# EAGLE design working (EAGLE 9.1.3)
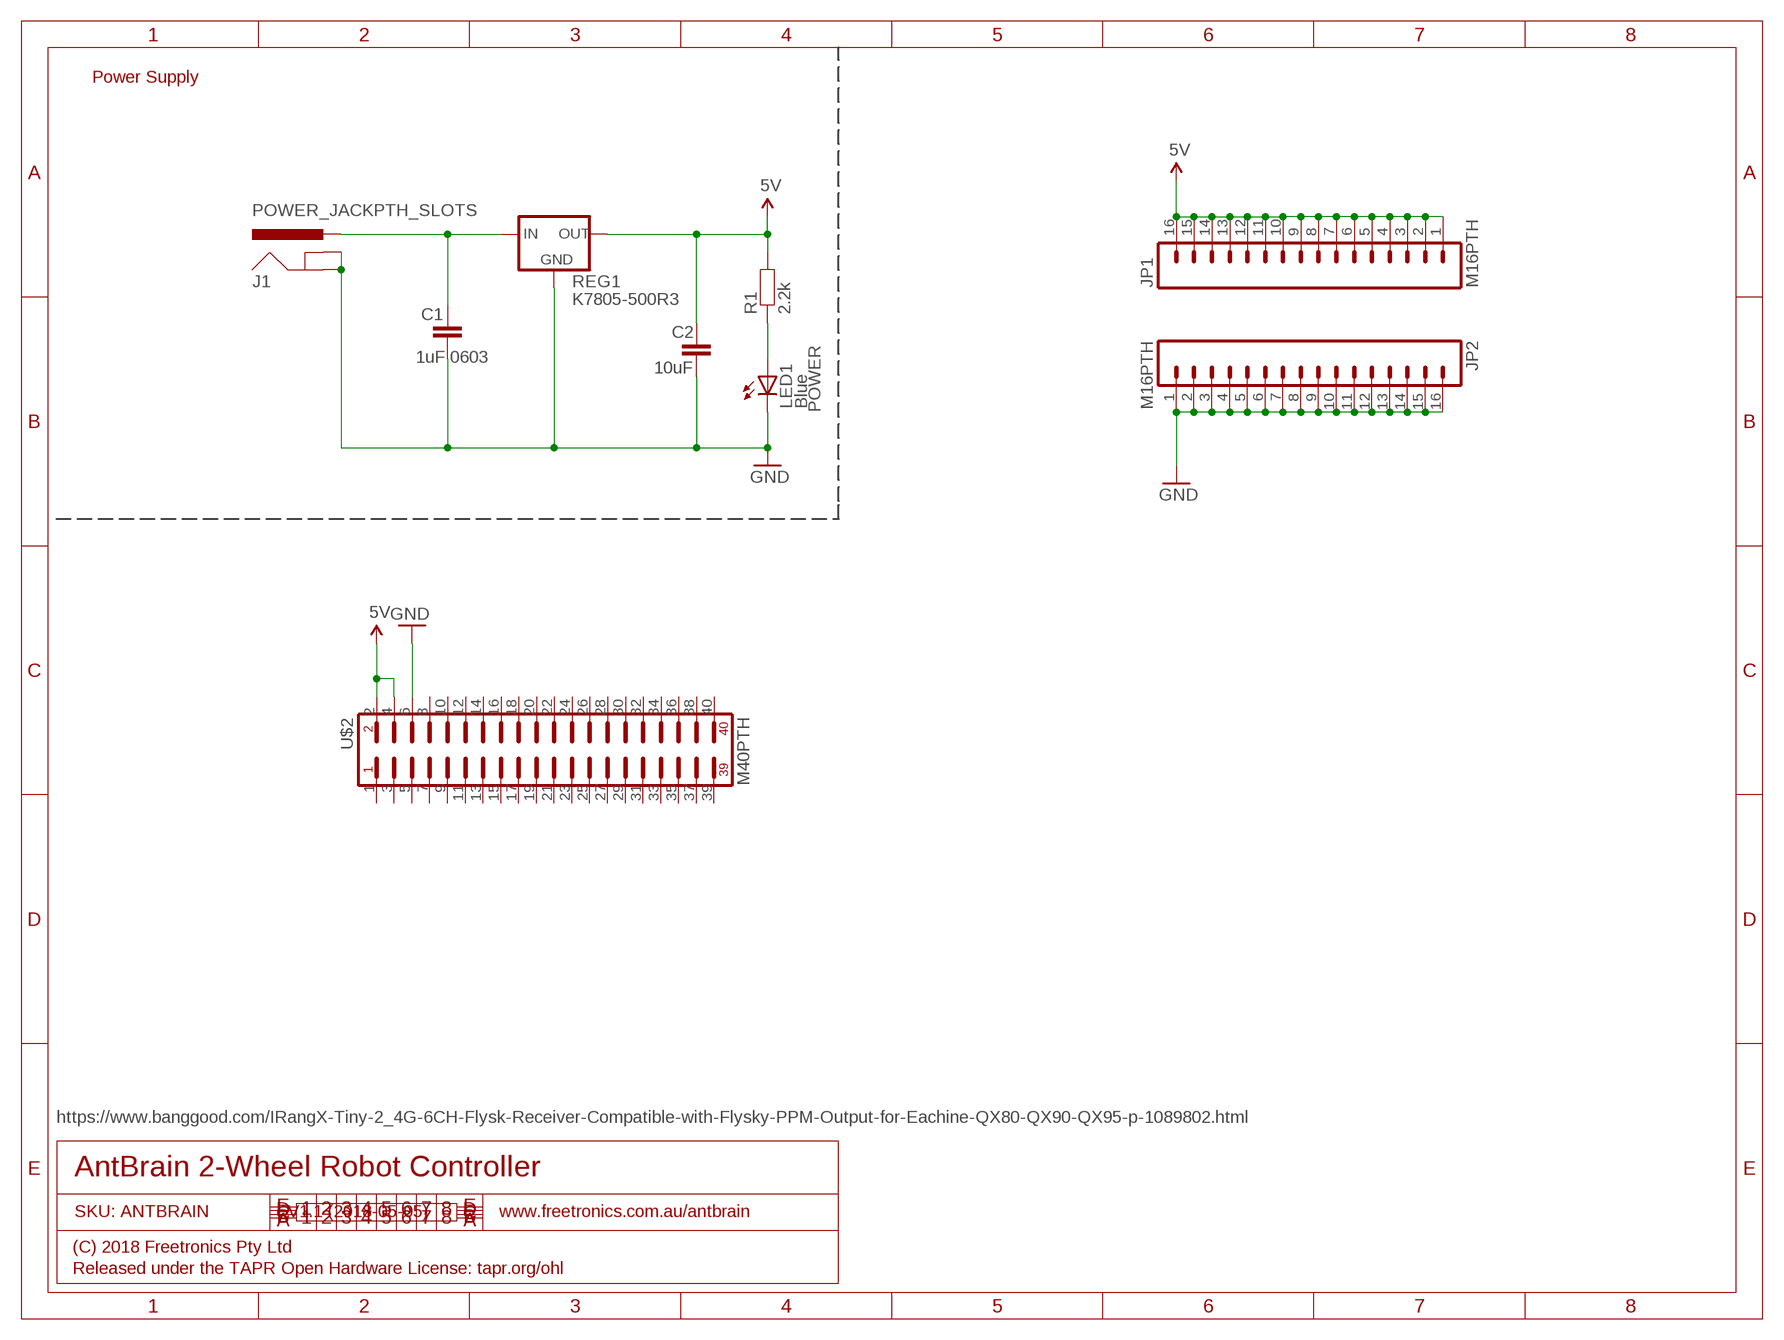
[diagram p0: schematic, sheet 1]

## Parts
C1  1uF 0603  CAP0603  [0603]
C2  10uF  CAP0805  [0805]
J1  POWER_JACKPTH_SLOTS  [POWER_JACK_PTH_SLOTS]
JP1  M16PTH  [1X16]
JP2  M16PTH  [1X16]
LED1  Blue  LED0603  [LED-0603]
R1  2.2k  RESISTOR0603  [0603]
REG1  K7805-500R3  K78XX-500R3  [K78XX-500R3]
U$2  M40PTH  [2X20]

## Nets
5V: C2.1 JP1.1 JP1.2 JP1.3 JP1.4 JP1.5 JP1.6 JP1.7 JP1.8 JP1.9 JP1.10 JP1.11 JP1.12 JP1.13 JP1.14 JP1.15 JP1.16 R1.2 REG1.3(OUT) U$2.2 U$2.4
GND: C1.2 C2.2 J1.GND J1.GNDBREAK JP2.1 JP2.2 JP2.3 JP2.4 JP2.5 JP2.6 JP2.7 JP2.8 JP2.9 JP2.10 JP2.11 JP2.12 JP2.13 JP2.14 JP2.15 JP2.16 LED1.C REG1.2(GND) U$2.6
N$1: LED1.A R1.1
VBAT: C1.1 J1.PWR REG1.1(IN)
Unconnected: U$2.1 U$2.3 U$2.5 U$2.7 U$2.8 U$2.9 U$2.10 U$2.11 U$2.12 U$2.13 U$2.14 U$2.15 U$2.16 U$2.17 U$2.18 U$2.19 U$2.20 U$2.21 U$2.22 U$2.23 U$2.24 U$2.25 U$2.26 U$2.27 U$2.28 U$2.29 U$2.30 U$2.31 U$2.32 U$2.33 U$2.34 U$2.35 U$2.36 U$2.37 U$2.38 U$2.39 U$2.40

## Notes on the sheet
- Power Supply
- POWER
- https://www.banggood.com/IRangX-Tiny-2_4G-6CH-Flysk-Receiver-Compatible-with-Flysky-PPM-Output-for-Eachine-QX80-QX90-QX95-p-1089802.html
- AntBrain 2-Wheel Robot Controller
- SKU: ANTBRAIN | V1.1 (2018-05-05) | www.freetronics.com.au/antbrain
- (C) 2018 Freetronics Pty Ltd
- Released under the TAPR Open Hardware License: tapr.org/ohl

## Library data of the parts
C1 = freetronics:CAP: Capacitor Standard 0603 ceramic capacitor, and 0.1" leaded capacitor.
C2 = freetronics-jon:CAP: Capacitor Standard 0603 ceramic capacitor, and 0.1" leaded capacitor.
J1 = freetronics-jon:POWER_JACK: Power Jack This is the standard 5.5mm barrel jack for power. The PTH is the most common, proven, reliable, footprint. All others are experimental. The Slot footprint only works if the mill layer is transmitted to the PCB fab house so be warned. Spark Fun Electronics SKU : PRT-00119. Mating wall wart : TOL-00298 (and others)
JP1 JP2 = freetronics-jon:M16
LED1 = freetronics-jon:LED: LEDs Standard schematic elements and footprints for 5mm, 3mm, 1206, and 0603 sized LEDs. 5mm - Spark Fun Electronics SKU : COM-00529 (and others)
R1 = freetronics-jon:RESISTOR: Resistor Basic schematic elements and footprints for 0603, 1206, and PTH 1/10th watt (small) resistors.
REG1 = freetronics-jon:K78XX-500R3
U$2 = freetronics-jon:M40

## Board
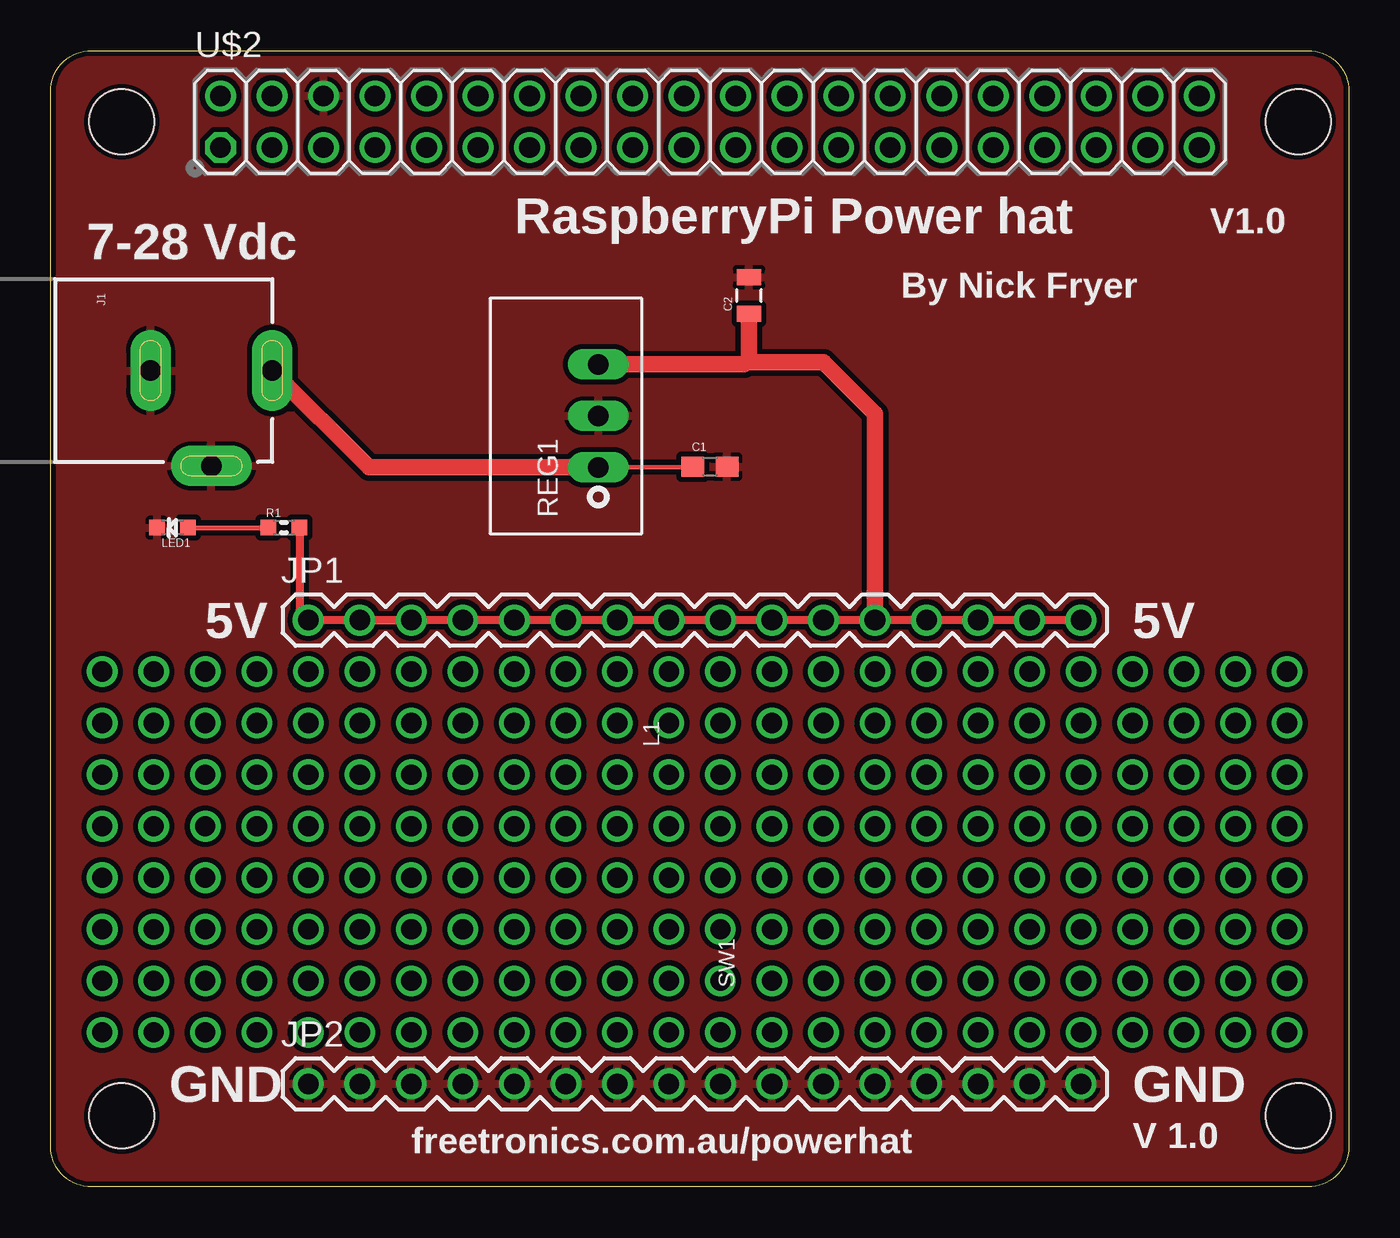
[diagram p1: board, top side]
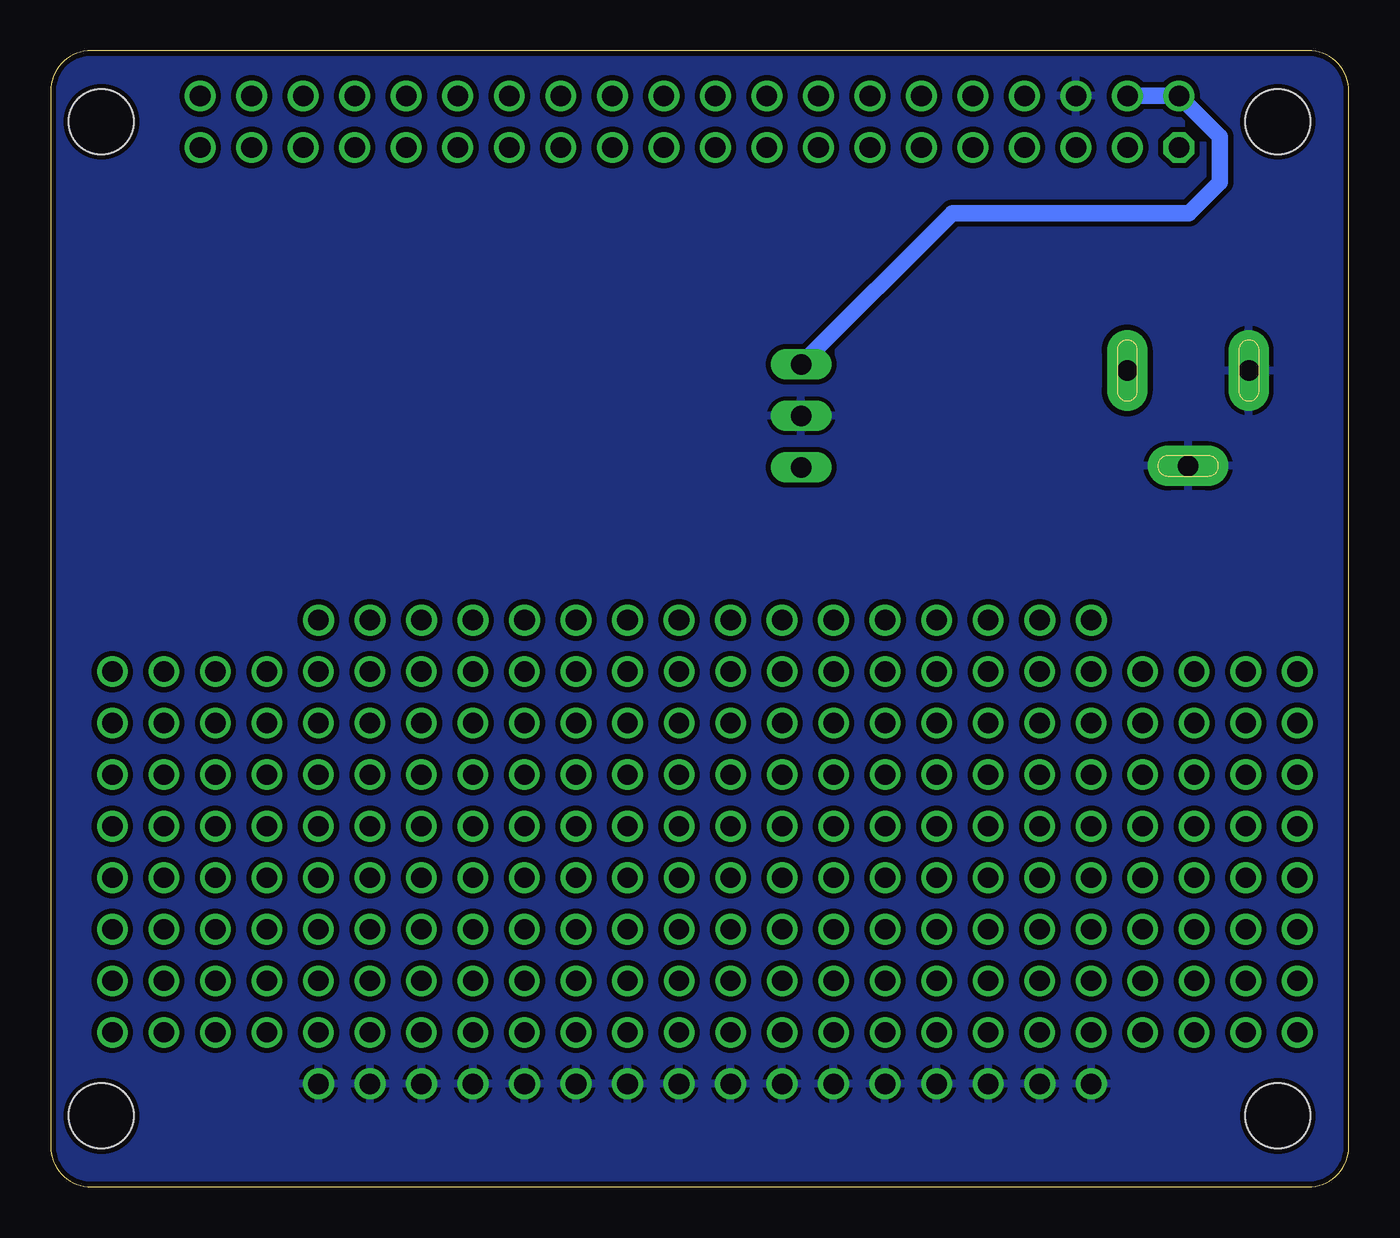
[diagram p2: board, bottom side, seen from below]

Size 64 x 56 mm. Coordinates in mm from the lower left corner, seen from the top.
Outline: 0,54 arc-90 2,56 62,56 arc-90 64,54 64,2 arc-90 62,0 2,0 arc-90 0,2 0,54
Copper layers (1*16): Top 0.035mm / dielectric 1.5mm / Bottom 0.035mm
Design rules "default *": minimum track width 8mil, minimum drill 0.4mm, track to track 8mil, track to pad 8mil, pad to pad 8mil, via to via 8mil, smd to smd 8mil, copper to edge 10mil, drill to drill 8mil, minimum pad ring 8mil, minimum via ring 10mil, stop-mask expansion 3mil, vias tented up to drill 25mil, thermal gap 8mil
Holes 3.2 mm at 3.5,52.5 61.5,52.5 61.5,3.5 3.5,3.5

### Footprints (pad centres in the part's own frame; a part is rotated, then mirrored left to right if it is on the bottom)
0603 = smd 1.1 x 1: 1 -0.85,0; 2 0.85,0
0805 = smd 0.8 x 1.2: 1 -0.9,0; 2 0.9,0
POWER_JACK_PTH_SLOTS = drill 1 pad 2 long: GND 0,7.7; GNDBREAK 4.7,10.7; PWR 0,13.7
1X16 = drill 1.016: 1 0,0; 2 2.54,0; 3 5.08,0; 4 7.62,0; 5 10.16,0; 6 12.7,0; 7 15.24,0; 8 17.78,0; 9 20.32,0; 10 22.86,0; 11 25.4,0; 12 27.94,0; 13 30.48,0; 14 33.02,0; 15 35.56,0; 16 38.1,0
LED-0603 = smd 0.762 x 0.762: A -0.762,0; C 0.762,0
0603' = smd 0.762 x 0.762: 1 -0.762,0; 2 0.762,0
K78XX-500R3 = drill 1 long: 1 -2.54,0; 2 0,0; 3 2.54,0
2X20 = drill 1.016 octagon: 1 0,0 | drill 1.016: 2 0,2.54; 3 2.54,0; 4 2.54,2.54; 5 5.08,0; 6 5.08,2.54; 7 7.62,0; 8 7.62,2.54; 9 10.16,0; 10 10.16,2.54; 11 12.7,0; 12 12.7,2.54; 13 15.24,0; 14 15.24,2.54; 15 17.78,0; 16 17.78,2.54; 17 20.32,0; 18 20.32,2.54; 19 22.86,0; 20 22.86,2.54; 21 25.4,0; 22 25.4,2.54; 23 27.94,0; 24 27.94,2.54; 25 30.48,0; 26 30.48,2.54; 27 33.02,0; 28 33.02,2.54; 29 35.56,0; 30 35.56,2.54; 31 38.1,0; 32 38.1,2.54; 33 40.64,0; 34 40.64,2.54; 35 43.18,0; 36 43.18,2.54; 37 45.72,0; 38 45.72,2.54; 39 48.26,0; 40 48.26,2.54

### Placement (x,y rotation side)
C1  32.5,35.5 0 top
C2  34.43,43.93 90 top
J1  -2.78,40.24 270 top
JP1  12.7,27.94 0 top
JP2  12.7,5.08 0 top
LED1  6,32.5 180 top
R1  2.2k  [0603']  11.5,32.5 0 top
REG1  27,38 90 top
U$2  8.37,51.23 0 top

### Tracks (layer width: path | path; a pad name or v marks a point on that pad's centre or on a via)
5V
  Top 0.406: JP1.16 JP1.15 JP1.14 JP1.13 JP1.12 JP1.11 JP1.10 JP1.9 JP1.8 JP1.7 JP1.6 JP1.5 JP1.4 JP1.3 | JP1.3 JP1.1 12.26,28.38 R1.2 | JP1.2 JP1.3
  Top 0.813: REG1.3 34.19,40.54 | C2.1 34.43,40.78 34.19,40.54 | 34.19,40.54 | 34.19,40.54 34.29,40.64 38.1,40.64 40.64,38.1 JP1.12
  Bottom 0.813: REG1.3 19.54,48 7.88,48 6.35,49.53 6.35,51.75 U$2.2 U$2.4
GND
  pour Top (isolate 0.254): 2,56 64,56 64,0 2,0 arc-90 0,2 0,54 arc-90
  pour Bottom (isolate 0.254): 2,56.32 61.94,56.32 arc-90 63.94,54.32 63.94,2 arc-90 61.94,0 2,0 arc-90 0,2 0,54.32 arc-90
N$1
  Top 0.254: LED1.A R1.1
N$2  (via drill 1)
  other vias: 7.62,25.4
N$3  (via drill 1)
  other vias: 10.16,25.4
N$4  (via drill 1)
  other vias: 12.7,25.4
N$5  (via drill 1)
  other vias: 15.24,25.4
N$6  (via drill 1)
  other vias: 17.78,25.4
N$7  (via drill 1)
  other vias: 20.32,25.4
N$8  (via drill 1)
  other vias: 22.86,25.4
N$9  (via drill 1)
  other vias: 25.4,25.4
N$10  (via drill 1)
  other vias: 27.94,25.4
N$11  (via drill 1)
  other vias: 30.48,25.4
N$12  (via drill 1)
  other vias: 33.02,25.4
N$13  (via drill 1)
  other vias: 35.56,25.4
N$14  (via drill 1)
  other vias: 38.1,25.4
N$15  (via drill 1)
  other vias: 40.64,25.4
N$16  (via drill 1)
  other vias: 43.18,25.4
N$17  (via drill 1)
  other vias: 45.72,25.4
N$18  (via drill 1)
  other vias: 48.26,25.4
N$19  (via drill 1)
  other vias: 50.8,25.4
N$20  (via drill 1)
  other vias: 53.34,25.4
N$21  (via drill 1)
  other vias: 55.88,25.4
N$22  (via drill 1)
  other vias: 58.42,25.4
N$23  (via drill 1)
  other vias: 60.96,25.4
N$24  (via drill 1)
  other vias: 5.08,25.4
N$25  (via drill 1)
  other vias: 2.54,25.4
N$26  (via drill 1)
  other vias: 7.62,22.86
N$27  (via drill 1)
  other vias: 10.16,22.86
N$28  (via drill 1)
  other vias: 12.7,22.86
N$29  (via drill 1)
  other vias: 15.24,22.86
N$30  (via drill 1)
  other vias: 17.78,22.86
N$31  (via drill 1)
  other vias: 20.32,22.86
N$32  (via drill 1)
  other vias: 22.86,22.86
N$33  (via drill 1)
  other vias: 25.4,22.86
N$34  (via drill 1)
  other vias: 27.94,22.86
N$35  (via drill 1)
  other vias: 30.48,22.86
N$36  (via drill 1)
  other vias: 33.02,22.86
N$37  (via drill 1)
  other vias: 35.56,22.86
N$38  (via drill 1)
  other vias: 38.1,22.86
N$39  (via drill 1)
  other vias: 40.64,22.86
N$40  (via drill 1)
  other vias: 43.18,22.86
N$41  (via drill 1)
  other vias: 45.72,22.86
N$42  (via drill 1)
  other vias: 48.26,22.86
N$43  (via drill 1)
  other vias: 50.8,22.86
N$44  (via drill 1)
  other vias: 53.34,22.86
N$45  (via drill 1)
  other vias: 55.88,22.86
N$46  (via drill 1)
  other vias: 58.42,22.86
N$47  (via drill 1)
  other vias: 60.96,22.86
N$48  (via drill 1)
  other vias: 5.08,22.86
N$49  (via drill 1)
  other vias: 2.54,22.86
N$50  (via drill 1)
  other vias: 7.62,20.32
N$51  (via drill 1)
  other vias: 10.16,20.32
N$52  (via drill 1)
  other vias: 12.7,20.32
N$53  (via drill 1)
  other vias: 15.24,20.32
N$54  (via drill 1)
  other vias: 17.78,20.32
N$55  (via drill 1)
  other vias: 20.32,20.32
N$56  (via drill 1)
  other vias: 22.86,20.32
N$57  (via drill 1)
  other vias: 25.4,20.32
N$58  (via drill 1)
  other vias: 27.94,20.32
N$59  (via drill 1)
  other vias: 30.48,20.32
N$60  (via drill 1)
  other vias: 33.02,20.32
N$61  (via drill 1)
  other vias: 35.56,20.32
N$62  (via drill 1)
  other vias: 38.1,20.32
N$63  (via drill 1)
  other vias: 40.64,20.32
N$64  (via drill 1)
  other vias: 43.18,20.32
N$65  (via drill 1)
  other vias: 45.72,20.32
N$66  (via drill 1)
  other vias: 48.26,20.32
N$67  (via drill 1)
  other vias: 50.8,20.32
N$68  (via drill 1)
  other vias: 53.34,20.32
N$69  (via drill 1)
  other vias: 55.88,20.32
N$70  (via drill 1)
  other vias: 58.42,20.32
N$71  (via drill 1)
  other vias: 60.96,20.32
N$72  (via drill 1)
  other vias: 5.08,20.32
N$73  (via drill 1)
  other vias: 2.54,20.32
N$74  (via drill 1)
  other vias: 7.62,17.78
N$75  (via drill 1)
  other vias: 10.16,17.78
N$76  (via drill 1)
  other vias: 12.7,17.78
N$77  (via drill 1)
  other vias: 15.24,17.78
N$78  (via drill 1)
  other vias: 17.78,17.78
N$79  (via drill 1)
  other vias: 20.32,17.78
N$80  (via drill 1)
  other vias: 22.86,17.78
N$81  (via drill 1)
  other vias: 25.4,17.78
N$82  (via drill 1)
  other vias: 27.94,17.78
N$83  (via drill 1)
  other vias: 30.48,17.78
N$84  (via drill 1)
  other vias: 33.02,17.78
N$85  (via drill 1)
  other vias: 35.56,17.78
N$86  (via drill 1)
  other vias: 38.1,17.78
N$87  (via drill 1)
  other vias: 40.64,17.78
N$88  (via drill 1)
  other vias: 43.18,17.78
N$89  (via drill 1)
  other vias: 45.72,17.78
N$90  (via drill 1)
  other vias: 48.26,17.78
N$91  (via drill 1)
  other vias: 50.8,17.78
N$92  (via drill 1)
  other vias: 53.34,17.78
N$93  (via drill 1)
  other vias: 55.88,17.78
N$94  (via drill 1)
  other vias: 58.42,17.78
N$95  (via drill 1)
  other vias: 60.96,17.78
N$96  (via drill 1)
  other vias: 5.08,17.78
N$97  (via drill 1)
  other vias: 2.54,17.78
N$98  (via drill 1)
  other vias: 7.62,15.24
N$99  (via drill 1)
  other vias: 10.16,15.24
N$100  (via drill 1)
  other vias: 12.7,15.24
N$101  (via drill 1)
  other vias: 15.24,15.24
N$102  (via drill 1)
  other vias: 17.78,15.24
N$103  (via drill 1)
  other vias: 20.32,15.24
N$104  (via drill 1)
  other vias: 22.86,15.24
N$105  (via drill 1)
  other vias: 25.4,15.24
N$106  (via drill 1)
  other vias: 27.94,15.24
N$107  (via drill 1)
  other vias: 30.48,15.24
N$108  (via drill 1)
  other vias: 33.02,15.24
N$109  (via drill 1)
  other vias: 35.56,15.24
N$110  (via drill 1)
  other vias: 38.1,15.24
N$111  (via drill 1)
  other vias: 40.64,15.24
N$112  (via drill 1)
  other vias: 43.18,15.24
N$113  (via drill 1)
  other vias: 45.72,15.24
N$114  (via drill 1)
  other vias: 48.26,15.24
N$115  (via drill 1)
  other vias: 50.8,15.24
N$116  (via drill 1)
  other vias: 53.34,15.24
N$117  (via drill 1)
  other vias: 55.88,15.24
N$118  (via drill 1)
  other vias: 58.42,15.24
N$119  (via drill 1)
  other vias: 60.96,15.24
N$120  (via drill 1)
  other vias: 5.08,15.24
N$121  (via drill 1)
  other vias: 2.54,15.24
N$122  (via drill 1)
  other vias: 7.62,12.7
N$123  (via drill 1)
  other vias: 10.16,12.7
N$124  (via drill 1)
  other vias: 12.7,12.7
N$125  (via drill 1)
  other vias: 15.24,12.7
N$126  (via drill 1)
  other vias: 17.78,12.7
N$127  (via drill 1)
  other vias: 20.32,12.7
N$128  (via drill 1)
  other vias: 22.86,12.7
N$129  (via drill 1)
  other vias: 25.4,12.7
N$130  (via drill 1)
  other vias: 27.94,12.7
N$131  (via drill 1)
  other vias: 30.48,12.7
N$132  (via drill 1)
  other vias: 33.02,12.7
N$133  (via drill 1)
  other vias: 35.56,12.7
N$134  (via drill 1)
  other vias: 38.1,12.7
N$135  (via drill 1)
  other vias: 40.64,12.7
N$136  (via drill 1)
  other vias: 43.18,12.7
N$137  (via drill 1)
  other vias: 45.72,12.7
N$138  (via drill 1)
  other vias: 48.26,12.7
N$139  (via drill 1)
  other vias: 50.8,12.7
N$140  (via drill 1)
  other vias: 53.34,12.7
N$141  (via drill 1)
  other vias: 55.88,12.7
N$142  (via drill 1)
  other vias: 58.42,12.7
N$143  (via drill 1)
  other vias: 60.96,12.7
N$144  (via drill 1)
  other vias: 5.08,12.7
N$145  (via drill 1)
  other vias: 2.54,12.7
N$146  (via drill 1)
  other vias: 7.62,10.16
N$147  (via drill 1)
  other vias: 10.16,10.16
N$148  (via drill 1)
  other vias: 12.7,10.16
N$149  (via drill 1)
  other vias: 15.24,10.16
N$150  (via drill 1)
  other vias: 17.78,10.16
N$151  (via drill 1)
  other vias: 20.32,10.16
N$152  (via drill 1)
  other vias: 22.86,10.16
N$153  (via drill 1)
  other vias: 25.4,10.16
N$154  (via drill 1)
  other vias: 27.94,10.16
N$155  (via drill 1)
  other vias: 30.48,10.16
N$156  (via drill 1)
  other vias: 33.02,10.16
N$157  (via drill 1)
  other vias: 35.56,10.16
N$158  (via drill 1)
  other vias: 38.1,10.16
N$159  (via drill 1)
  other vias: 40.64,10.16
N$160  (via drill 1)
  other vias: 43.18,10.16
N$161  (via drill 1)
  other vias: 45.72,10.16
N$162  (via drill 1)
  other vias: 48.26,10.16
N$163  (via drill 1)
  other vias: 50.8,10.16
N$164  (via drill 1)
  other vias: 53.34,10.16
N$165  (via drill 1)
  other vias: 55.88,10.16
N$166  (via drill 1)
  other vias: 58.42,10.16
N$167  (via drill 1)
  other vias: 60.96,10.16
N$168  (via drill 1)
  other vias: 5.08,10.16
N$169  (via drill 1)
  other vias: 2.54,10.16
N$170  (via drill 1)
  other vias: 7.62,7.62
N$171  (via drill 1)
  other vias: 10.16,7.62
N$172  (via drill 1)
  other vias: 12.7,7.62
N$173  (via drill 1)
  other vias: 15.24,7.62
N$174  (via drill 1)
  other vias: 17.78,7.62
N$175  (via drill 1)
  other vias: 20.32,7.62
N$176  (via drill 1)
  other vias: 22.86,7.62
N$177  (via drill 1)
  other vias: 25.4,7.62
N$178  (via drill 1)
  other vias: 27.94,7.62
N$179  (via drill 1)
  other vias: 30.48,7.62
N$180  (via drill 1)
  other vias: 33.02,7.62
N$181  (via drill 1)
  other vias: 35.56,7.62
N$182  (via drill 1)
  other vias: 38.1,7.62
N$183  (via drill 1)
  other vias: 40.64,7.62
N$184  (via drill 1)
  other vias: 43.18,7.62
N$185  (via drill 1)
  other vias: 45.72,7.62
N$186  (via drill 1)
  other vias: 48.26,7.62
N$187  (via drill 1)
  other vias: 50.8,7.62
N$188  (via drill 1)
  other vias: 53.34,7.62
N$189  (via drill 1)
  other vias: 55.88,7.62
N$190  (via drill 1)
  other vias: 58.42,7.62
N$191  (via drill 1)
  other vias: 60.96,7.62
N$192  (via drill 1)
  other vias: 5.08,7.62
N$193  (via drill 1)
  other vias: 2.54,7.62
VBAT
  Top 0.254: REG1.1 C1.1
  Top 0.813: J1.PWR 15.7,35.46 REG1.1

### Text on the board
tPlace: RaspberryPi Power hat | V1.0 | 7-28 Vdc | By Nick Fryer | 5V | 5V | GND | GND | V 1.0 | freetronics.com.au/powerhat
tNames: L1 | SW1